# Altium schematic sheet BOC_Audio.SchDoc: Board-On-Chip Audio Interface
size A; Organization: Altium Limited; Address1: L3, 12a Rodborough Rd; Address2: Frenchs Forest; Address3: NSW; Address4: Australia 2086; Revision: 1.06; SheetNumber: 3; SheetTotal: 16
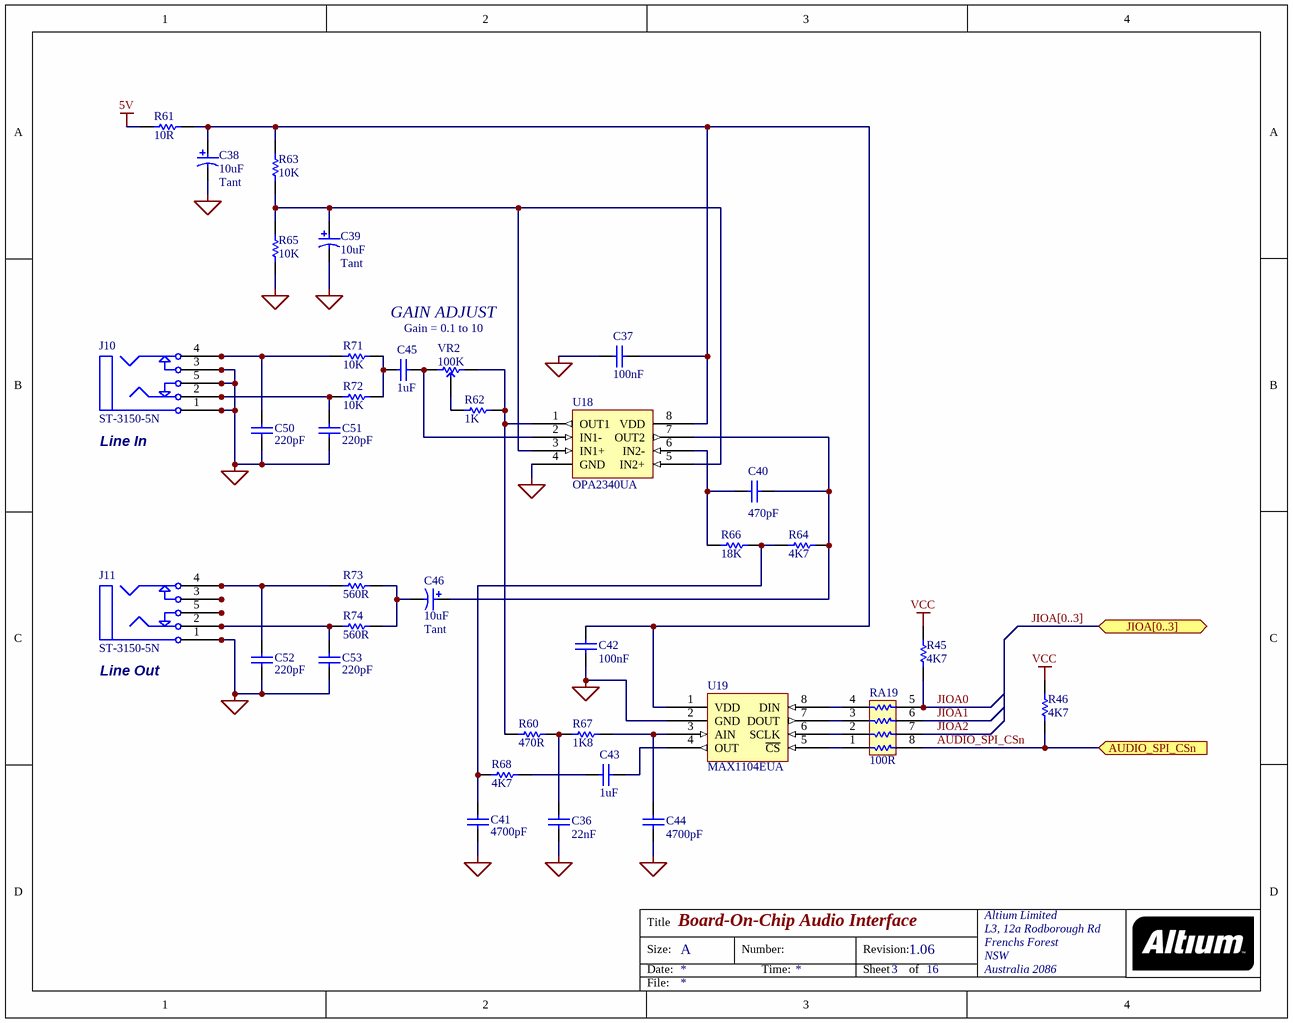
[diagram p0: BOC_Audio.SchDoc]

## Parts
C36  22nF  [CC2012-0805]
C37  100nF  [CC2012-0805]
C38  10uF  Capacitor Type: Tant  [MCCT-B]
C39  10uF  Capacitor Type: Tant  [MCCT-B]
C40  470pF  [CC2012-0805]
C41  4700pF  [CC2012-0805]
C42  100nF  [CC2012-0805]
C43  1uF  [C3216-1206]
C44  4700pF  [CC2012-0805]
C45  1uF  [C3216-1206]
C46  10uF  Capacitor Type: Tant  [MCCT-B]
C50  220pF  [CC2012-0805]
C51  220pF  [CC2012-0805]
C52  220pF  [CC2012-0805]
C53  220pF  [CC2012-0805]
J10  ST-3150-5N  [ST-3150-5N]
J11  ST-3150-5N  [ST-3150-5N]
R45  4K7  [CC2012-0805]
R46  4K7  [CC2012-0805]
R60  470R  [CC2012-0805]
R61  10R  [CC2012-0805]
R62  1K  [CC2012-0805]
R63  10K  [CC2012-0805]
R64  4K7  [CC2012-0805]
R65  10K  [CC2012-0805]
R66  18K  [CC2012-0805]
R67  1K8  [CC2012-0805]
R68  4K7  [CC2012-0805]
R71  10K  [CC2012-0805]
R72  10K  [CC2012-0805]
R73  560R  [CC2012-0805]
R74  560R  [CC2012-0805]
RA19  100R  [MNR34]
U18  OPA2340UA  [SO-G8]
U19  MAX1104EUA  [TSSO3X5-G8/X.35]
VR2  100K  [POT4MM-2]

## Ports
AUDIO_SPI_CSn (in), JIOA[0..3] (bidir)

## Nets
5V: R61.1
AGND: C36.2 C37.1 C38.2 C39.2 C41.2 C42.2 C44.2 C50.2 C51.2 C52.2 C53.2 J10.1 J10.1A J10.1B J10.3 J10.3A J10.3B J10.5 J10.5A J10.5B J11.1 J11.1A J11.1B R65.1 U18.4(GND) U19.2(GND)
VCC: R45.2 R46.2
AUDIO_SPI_CSn: R46.1 RA19.8 ; port AUDIO_SPI_CSn
JIOA0: R45.1 RA19.5
JIOA1: RA19.6
JIOA2: RA19.7
NetC36_1: C36.1 R60.2 R67.1
NetC37_2: C37.2 C38.1 C42.1 R61.2 R63.2 U18.8(VDD) U19.1(VDD)
NetC39_1: C39.1 R63.1 R65.2 U18.3(IN1+) U18.5(IN2+)
NetC40_1: C40.1 R66.2 U18.6(IN2-)
NetC40_2: C40.2 C46.1 R64.1 U18.7(OUT2)
NetC41_1: C41.1 R64.2 R66.1 R68.1
NetC43_1: C43.1 R68.2
NetC43_2: C43.2 U19.4(OUT)
NetC44_1: C44.1 R67.2 U19.3(AIN)
NetC45_1: C45.1 R71.2 R72.2
NetC45_2: C45.2 U18.2(IN1-) VR2.CCW(-)
NetC46_2: C46.2 R73.2 R74.2
NetC50_1: C50.1 J10.4 J10.4A J10.4B R71.1
NetC51_1: C51.1 J10.2 J10.2A J10.2B R72.1
NetC52_1: C52.1 J11.4 J11.4A J11.4B R73.1
NetC53_1: C53.1 J11.2 J11.2A J11.2B R74.1
NetJ11_3: J11.3 J11.3A J11.3B
NetJ11_5: J11.5 J11.5A J11.5B
NetR60_1: R60.1 R62.2 U18.1(OUT1) VR2.CW(+)
NetR62_1: R62.1 VR2.W
NetRA19_1: RA19.1 U19.5(~{CS})
NetRA19_2: RA19.2 U19.6(SCLK)
NetRA19_3: RA19.3 U19.7(DOUT)
NetRA19_4: RA19.4 U19.8(DIN)

## Buses and harness runs
bus JIOA[0..3] = port JIOA[0..3]

## Notes on the sheet
- GAIN ADJUST
- Gain = 0.1 to 10
- (near J10) Line In
- (near J11) Line Out
- Title
- Size:
- Date:
- A
- Number:
- Time:
- Revision:
- Sheet
- of
- File:

## Library data of the parts
C36 C37 C40-C45 C50-C53 = CAP: Capacitor; Fitted: True
C38 C39 C46 = CAP_POLAR: Polar Capacitor; Fitted: True
J10 J11 = ST-3150-5N: 3-Conductor Jack with 2 break contacts (normals) and 2 auxiliary make contacts; Manufacturer: Kycon; Class I: Connector; Fitted: True; Revision: December-2003: Created for NanoBoard.; Publisher: Altium Limited
R45 R46 R60-R68 R71-R74 = RES: Resistor; Fitted: True
RA19 = MNR34: 3216x4 Resistor Array; Fitted: True
U18 = OPA2340UA: Manufacturer: Burr-Brown; Fitted: True
U19 = MAX1104EUA: 8 bit CODEC with 4 wire logic interface; Manufacturer: Maxim; Fitted: True
VR2 = POT_M: Potentiometer; Fitted: True